# EAGLE design shield carte avant (EAGLE 9.2.1)
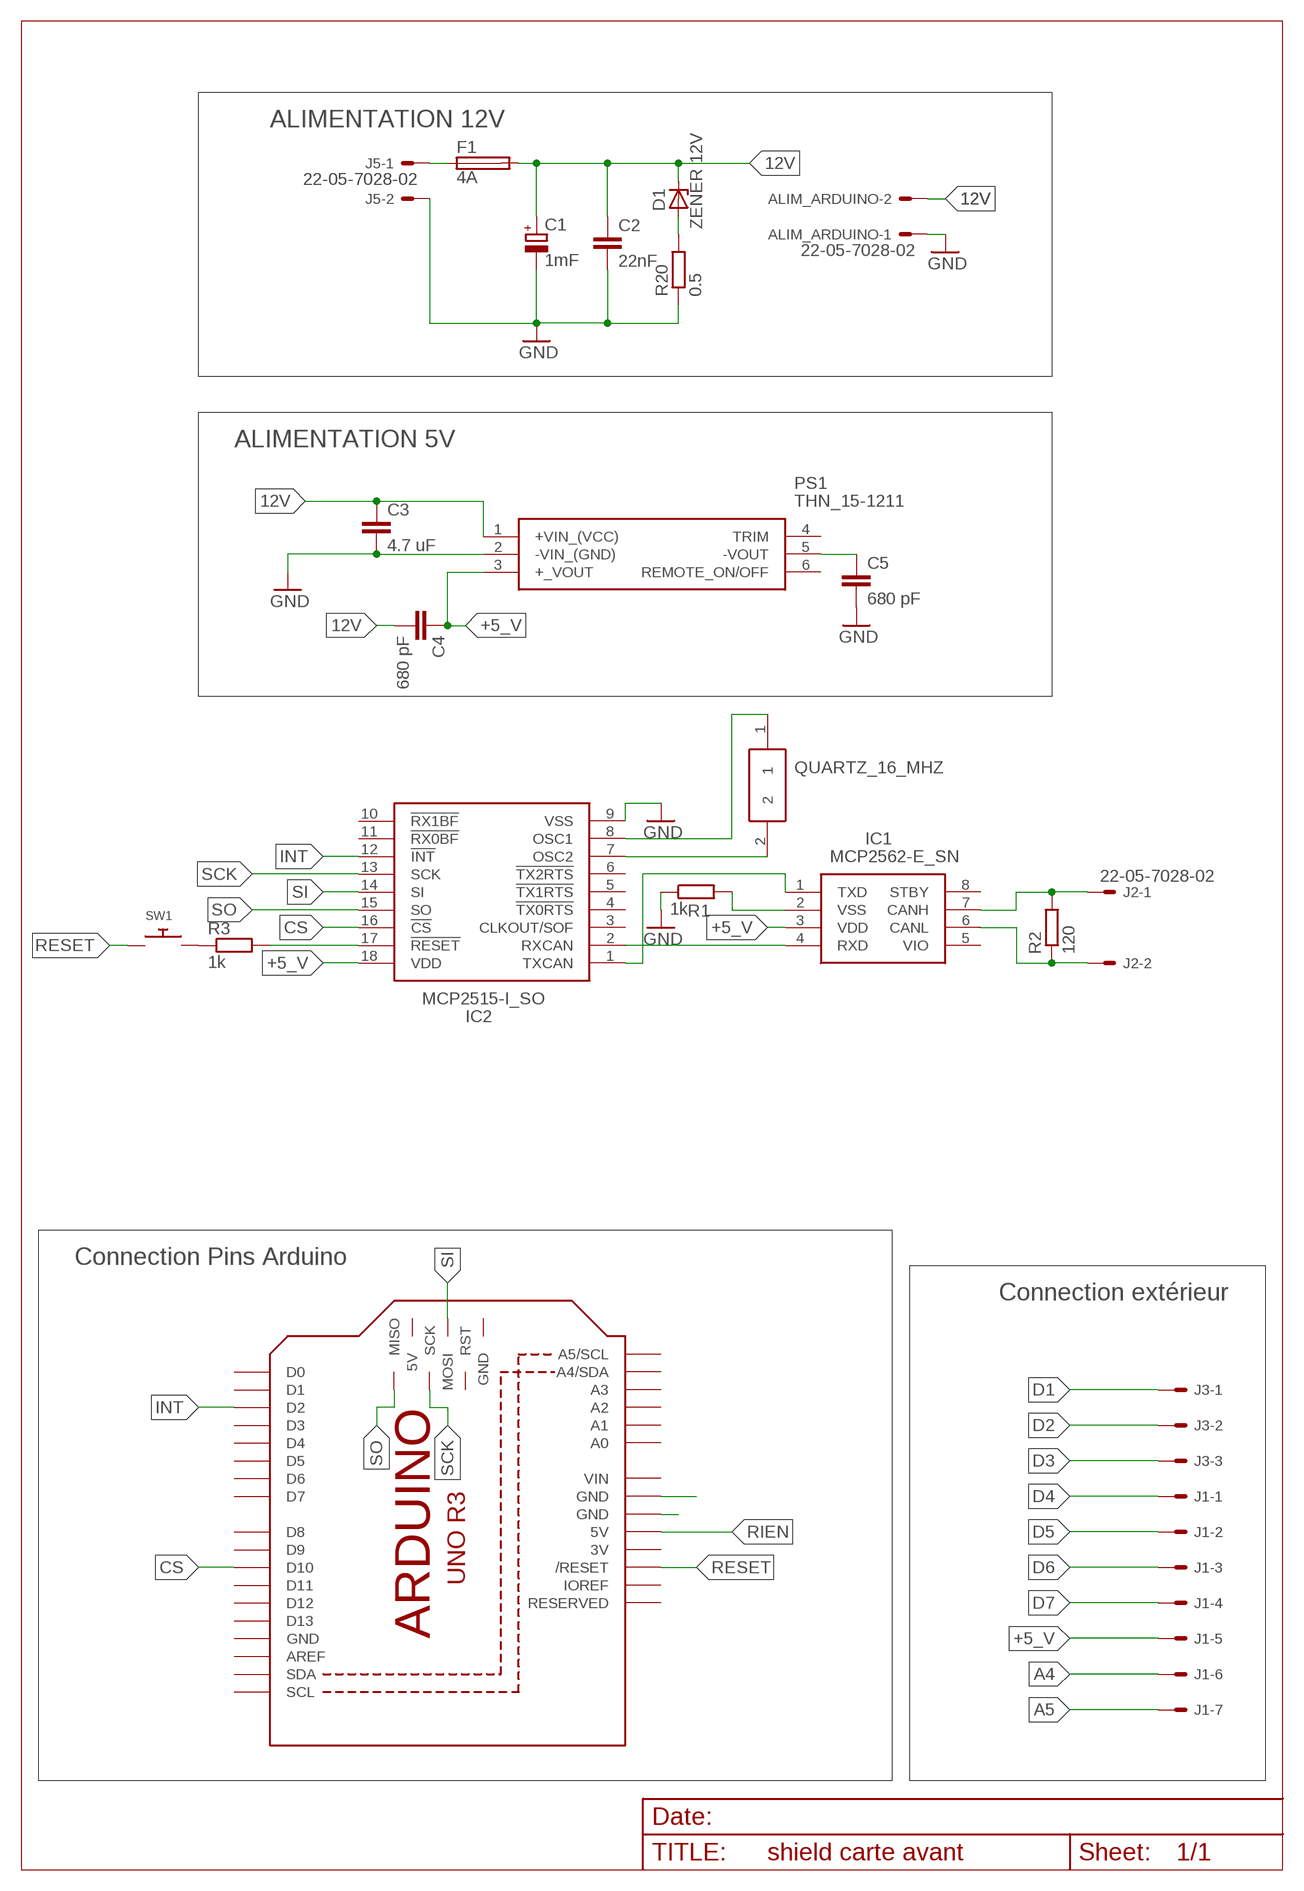
[diagram p0: schematic, sheet 1]

## Parts
ALIM_ARDUINO  22-05-7028-02  [7395-02]
C1  1mF  CPOL-EUE7.5-16  [E7,5-16]
C2  22nF  C-EU025-025X050  [C025-025X050]
C3  4.7 uF  C-EU025-024X044  [C025-024X044]
C4  680 pF  C-EU025-024X044  [C025-024X044]
C5  680 pF  C-EU025-024X044  [C025-024X044]
D1  ZENER 12V  ZENER-DIODEDO41Z10  [DO41Z10]
F1  4A  SH25  [SH25]
IC1  MCP2562-E_SN  [SOIC127P600X175-8N]
IC2  MCP2515-I_SO  [SOIC127P1030X265-18N]
J1  22-05-7078-07  [7395-07]
J2  22-05-7028-02  [7395-02]
J3  22-05-7038-03  [7395-03]
J5  22-05-7028-02  [7395-02]
M1  ARDUINO_R3_ICSP  [ARDUINOR3_ICSP]
PS1  THN_15-1211  [THN-15-SERIES]
QUARTZ_16_MHZ  FOXSLF_160-20  [HC49SLF_1]
R1  1k  R-EU_0204/7  [0204/7]
R2  120  R-EU_0204/7  [0204/7]
R3  1k  R-EU_0204/7  [0204/7]
R20  0.5  R-EU_0309/12  [0309/12]
SW1  SWITCH_PUSHBUTTONEVQ-PE  [TACT_PANA-EVQ]

## Nets
12V [Vcc12]: ALIM_ARDUINO.2 C1.+ C2.1 C3.1 C4.2 D1.C F1.2 PS1.1(+VIN_(VCC))
+5_V: C4.1 IC1.3(VDD) IC2.18(VDD) J1.5 PS1.3(+_VOUT)
A4: J1.6
A5: J1.7
CS: IC2.16(!CS) M1.D10
D1: J3.1
D2: J3.2
D3: J3.3
D4: J1.1
D5: J1.2
D6: J1.3
D7: J1.4
GND: ALIM_ARDUINO.1 C1.- C2.2 C3.2 C5.2 IC2.9(VSS) J5.2 PS1.2(-VIN_(GND)) R1.1 R20.1
INT: IC2.12(!INT) M1.D2
N$1: F1.1 J5.1
N$3: C5.1 PS1.5(-VOUT)
N$4: D1.A R20.2
N$5: IC1.1(TXD) IC2.1(TXCAN)
N$6: IC1.4(RXD) IC2.2(RXCAN)
N$7: IC1.2(VSS) R1.2
N$8: IC1.7(CANH) J2.1 R2.2
N$9: IC1.6(CANL) J2.2 R2.1
N$10: IC2.7(OSC2) QUARTZ_16_MHZ.2
N$11: IC2.8(OSC1) QUARTZ_16_MHZ.1
N$13: M1.GND@1(GND)
N$14: R3.1 SW1.P$2
N$15: IC2.17(!RESET) R3.2
N$16: M1.GND@3(GND)
RESET: M1.RESET(/RESET) SW1.P$1
RIEN: M1.5V
SCK: IC2.13(SCK) M1.SCK
SI: IC2.14(SI) M1.MOSI
SO: IC2.15(SO) M1.MISO
Unconnected: IC1.5(VIO) IC1.8(STBY) IC2.3(CLKOUT/SOF) IC2.4(!TX0RTS) IC2.5(!TX1RTS) IC2.6(!TX2RTS) IC2.10(!RX1BF) IC2.11(!RX0BF) M1.5V_ICSP(5V) M1.A0 M1.A1 M1.A2 M1.A3 M1.A4(A4/SDA) M1.A5(A5/SCL) M1.AREF M1.D0 M1.D1 M1.D3 M1.D4 M1.D5 M1.D6 M1.D7 M1.D8 M1.D9 M1.D11 M1.D12 M1.D13 M1.GND@2(GND) M1.IOREF M1.RESERVED M1.RESET_ICSP(RST) M1.SCL M1.SDA PS1.4(TRIM) PS1.6(REMOTE_ON/OFF)

## Notes on the sheet
- ALIMENTATION 12V
- ALIMENTATION 5V
- Connection Pins Arduino
- Connection extérieur

## Power pins joined to a net without a drawn wire
3V: M1.3V
GND: M1.GND
VIN: M1.VIN

## Library data of the parts
ALIM_ARDUINO J5 = EP_molex_6410_7395:22-?-02: CONNECTOR wire to board 2.54 mm (.1 inch) pitch header
C1 = rcl:CPOL-EU: POLARIZED CAPACITOR, European symbol
C2 = rcl:C-EU: CAPACITOR, European symbol
C3-C5 = rcl:C-EU: CAPACITOR, European symbol; SPICEPREFIX: C
D1 = diode:ZENER-DIODE: Z-Diode
F1 = fuse:SH25: FUSE HOLDER grid 25 mm, OGN0031 8211, Schurter (Buerklin); MF: SCHURTER; MPN: 0031.8211; OC_FARNELL: 1162741; OC_NEWARK: 96B9380
IC1 = MCP2562-E_SN:MCP2562-E_SN: CAN Transceiver 1Mbps 5V 125degC SOIC8 CAN Transceiver 1MBps IEC 61000-4-2 Standby-Mode 8pins SOIC Source: Datasheet <http://uk.rs-online.com/web/p/products/7990228P>; ALLIED_NUMBER: 70415107; DESCRIPTION: CAN Transceiver 1Mbps 5V 125degC SOIC8 CAN Transceiver 1MBps IEC 61000-4-2 Standby-Mode 8pins SOIC; HEIGHT: 1.75mm; MANUFACTURER_NAME: Microchip; MANUFACTURER_PART_NUMBER: MCP2562-E/SN; RS_PART_NUMBER: 7990228P
IC2 = MCP2515-I_SO:MCP2515-I_SO: CAN Controller SPI data filtering SO18 Source: Datasheet <http://uk.rs-online.com/web/p/products/1445765>; ALLIED_NUMBER: 70045399; DESCRIPTION: CAN Controller SPI data filtering SO18; HEIGHT: 2.65mm; MANUFACTURER_NAME: Microchip; MANUFACTURER_PART_NUMBER: MCP2515-I/SO; RS_PART_NUMBER: 1445765
J1 = con-molex:22-?-07: CONNECTOR wire to board 2.54 mm (.1 inch) pitch header; MF: MOLEX; OC_FARNELL: unknown; OC_NEWARK: unknown
J2 = con-molex:22-?-02: CONNECTOR wire to board 2.54 mm (.1 inch) pitch header; MF: MOLEX; OC_FARNELL: 9731601; OC_NEWARK: unknown
J3 = con-molex:22-?-03: CONNECTOR wire to board 2.54 mm (.1 inch) pitch header; MF: MOLEX; OC_FARNELL: unknown; OC_NEWARK: unknown
M1 = adafruit:ARDUINO_R3_ICSP
PS1 = THN_15-1211:THN_15-1211: TRACOPOWER Isolated DC-DC Converter, Vin 9 18 V dc, Vout 5V dc, I/O isolation 1500V dc Source: Datasheet <http://uk.rs-online.com/web/p/products/0438272P>; DESCRIPTION: TRACOPOWER Isolated DC-DC Converter, Vin 9 18 V dc, Vout 5V dc, I/O isolation 1500V dc; HEIGHT: mm; MANUFACTURER_NAME: Traco Power; MANUFACTURER_PART_NUMBER: THN 15-1211; RS_PART_NUMBER: 0438272P
QUARTZ_16_MHZ = FOXSLF_160-20:FOXSLF_160-20: Crystal 16.000MHz HC49S HC-49-SLF Crystal 16MHz, ??30ppm, 2-Pin Source: Datasheet <http://uk.rs-online.com/web/p/products/1734298>; DESCRIPTION: Crystal 16.000MHz HC49S HC-49-SLF Crystal 16MHz, ??30ppm, 2-Pin; HEIGHT: mm; MANUFACTURER_NAME: Fox; MANUFACTURER_PART_NUMBER: FOXSLF/160-20; RS_PART_NUMBER: 1734298
R1-R3 = rcl:R-EU_: RESISTOR, European symbol; SPICEPREFIX: R
R20 = resistor:R-EU_: RESISTOR, European symbol
SW1 = adafruit:SWITCH_PUSHBUTTON: Buttons SOFTTOUCHSMD_SJ - Soft touch temporary push button (Super Junk Akihabara) Compatible with SKPMANE010 [Mouser: 688-SKPMAN] C&K_KSS = Digikey: KSS221GLFS

## Net classes
0 default: width 0.61 mm
1 Vcc12: width 1.016 mm

## Board
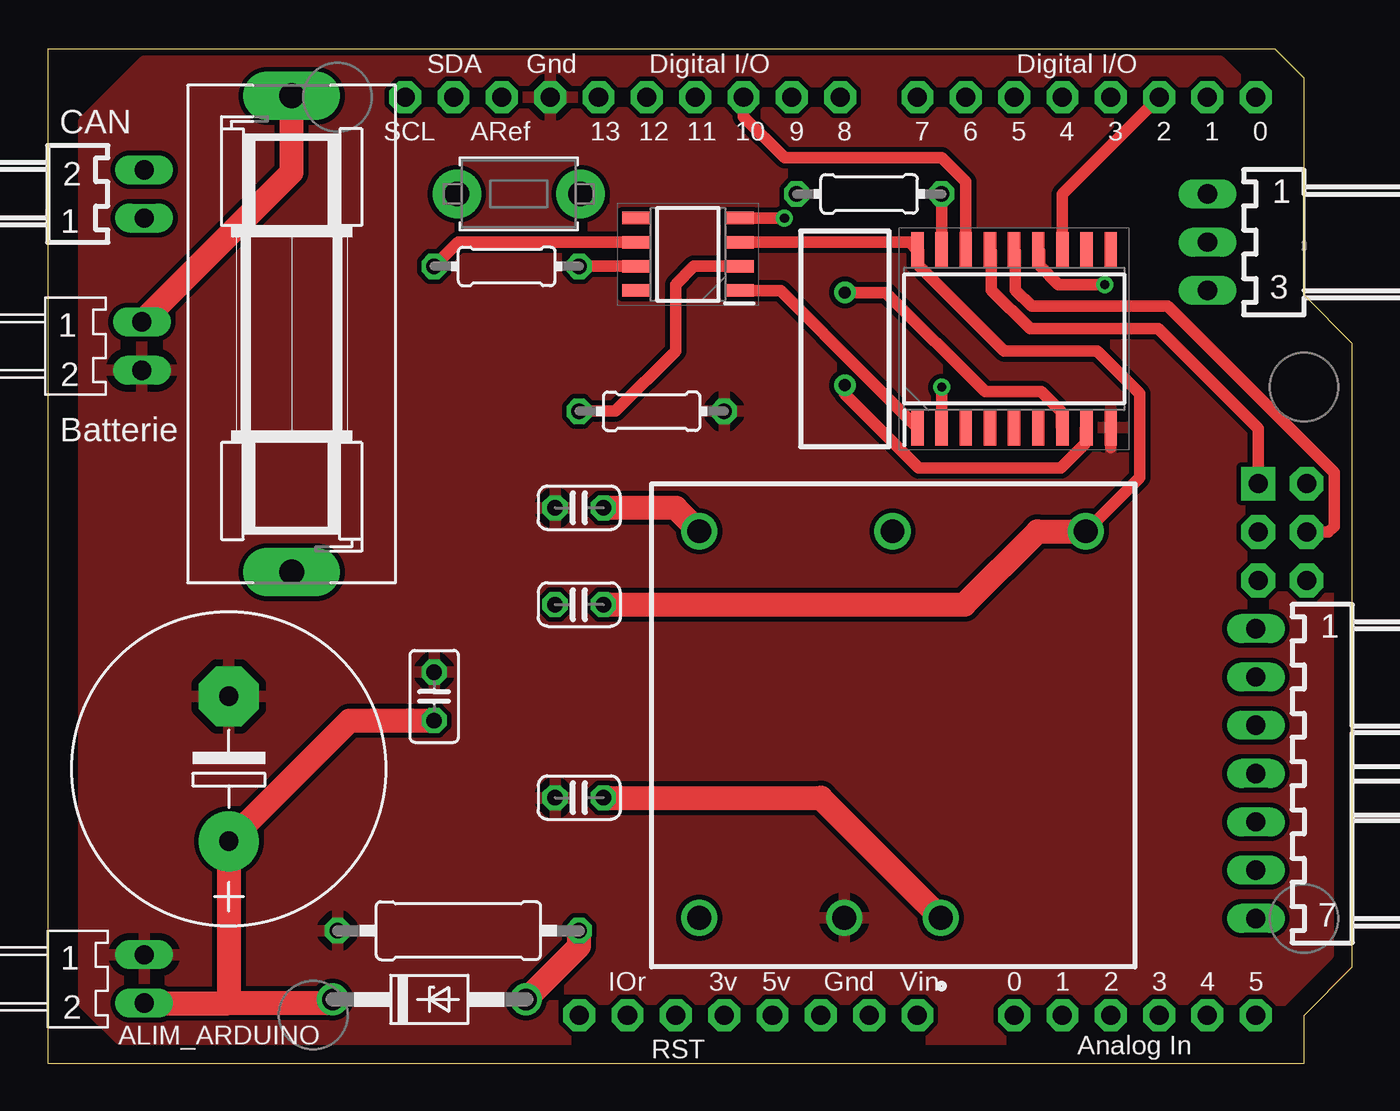
[diagram p1: board, top side]
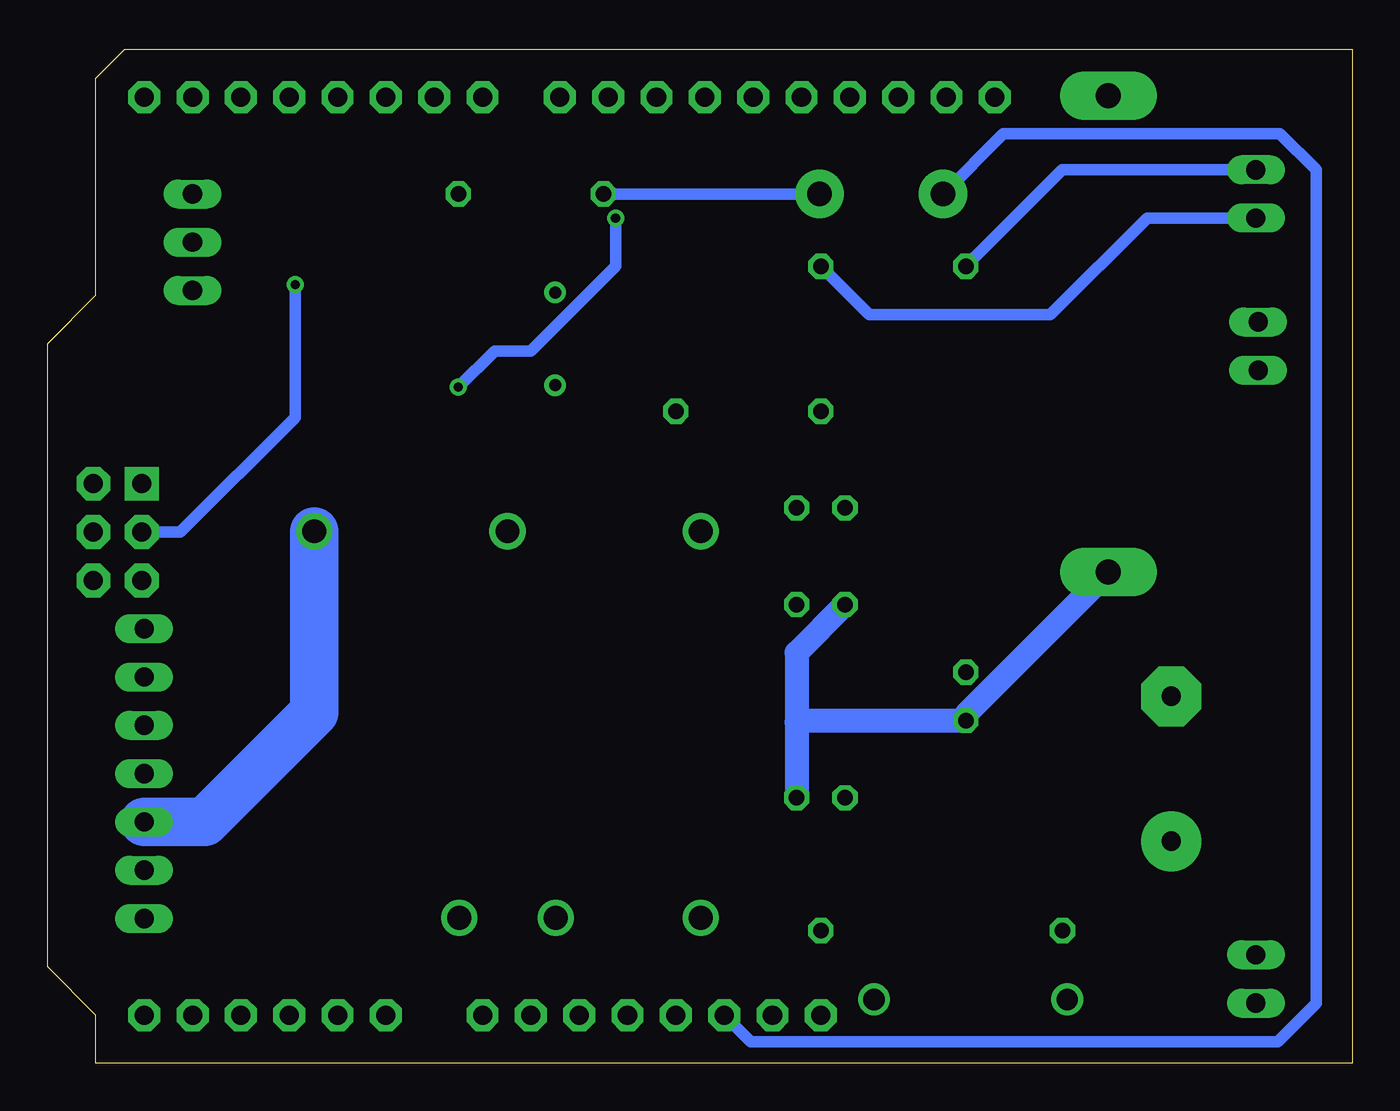
[diagram p2: board, bottom side, seen from below]

Size 68.58 x 53.34 mm. Coordinates in mm from the lower left corner, seen from the top.
Copper layers (1*16): Top 0.035mm / dielectric 1.5mm / Bottom 0.035mm
Design rules "default *": minimum track width 10mil, minimum drill 19mil, track to track 10mil, track to pad 10mil, pad to pad 0mil, via to via 10mil, smd to smd 0mil, copper to edge 10mil, drill to drill 8mil, minimum pad ring 10mil, minimum via ring 8mil, stop-mask expansion 4mil, vias tented up to drill 0mil, thermal gap 15mil

### Footprints (pad centres in the part's own frame; a part is rotated, then mirrored left to right if it is on the bottom)
7395-02 = drill 1.016 long: 1 1.27,0; 2 -1.27,0
E7,5-16 = drill 1.016 pad 3.15: + -3.81,0 | drill 1.016 pad 3.15 octagon: - 3.81,0
C025-025X050 = drill 0.813 octagon: 1 -1.27,0; 2 1.27,0
C025-024X044 = drill 0.813 octagon: 1 -1.27,0; 2 1.27,0
DO41Z10 = drill 1.118: A 5.08,0; C -5.08,0
SH25 = drill 1.321 pad 2.54 long: 1 -12.522,0; 2 12.522,0
SOIC127P600X175-8N = smd 1.5 x 0.65: 1 -2.7,1.905; 2 -2.7,0.635; 3 -2.7,-0.635; 4 -2.7,-1.905; 5 2.7,-1.905; 6 2.7,-0.635; 7 2.7,0.635; 8 2.7,1.905
SOIC127P1030X265-18N = smd 1.85 x 0.65: 1 -4.675,5.08; 2 -4.675,3.81; 3 -4.675,2.54; 4 -4.675,1.27; 5 -4.675,0; 6 -4.675,-1.27; 7 -4.675,-2.54; 8 -4.675,-3.81; 9 -4.675,-5.08; 10 4.675,-5.08; 11 4.675,-3.81; 12 4.675,-2.54; 13 4.675,-1.27; 14 4.675,0; 15 4.675,1.27; 16 4.675,2.54; 17 4.675,3.81; 18 4.675,5.08
7395-07 = drill 1.016 long: 1 7.62,0; 2 5.08,0; 3 2.54,0; 4 0,0; 5 -2.54,0; 6 -5.08,0; 7 -7.62,0
7395-03 = drill 1.016 long: 1 2.54,0; 2 0,0; 3 -2.54,0
ARDUINOR3_ICSP = drill 1 pad 1.676 octagon: 3V 35.56,2.54; 5V 38.1,2.54; A0 50.8,2.54; A1 53.34,2.54; A2 55.88,2.54; A3 58.42,2.54; A4 60.96,2.54; A5 63.5,2.54; AREF 23.876,50.8; D0 63.5,50.8; D1 60.96,50.8; D2 58.42,50.8; D3 55.88,50.8; D4 53.34,50.8; D5 50.8,50.8; D6 48.26,50.8; D7 45.72,50.8; D8 41.656,50.8; D9 39.116,50.8; D10 36.576,50.8; D11 34.036,50.8; D12 31.496,50.8; D13 28.956,50.8; GND 26.416,50.8; GND@1 43.18,2.54; GND@2 40.64,2.54; IOREF 30.48,2.54; RESERVED 27.94,2.54; RESET 33.02,2.54; SCL 18.796,50.8; SDA 21.336,50.8; VIN 45.72,2.54 | drill 1 pad 1.778 octagon: 5V_ICSP 66.167,30.48; GND@3 66.167,25.4; MOSI 66.167,27.94; RESET_ICSP 63.627,25.4; SCK 63.627,27.94 | drill 1 pad 1.778 square: MISO 63.627,30.48
THN-15-SERIES = drill 1.25 pad 1.9: 1 15.2,-22.82; 2 10.12,-22.82; 3 22.82,-2.5; 4 12.66,-2.5; 5 2.5,-2.5; 6 2.5,-22.82
HC49SLF_1 = drill 0.63 pad 1.13: 1 -2.44,0; 2 2.44,0
0204/7 = drill 0.813 octagon: 1 -3.81,0; 2 3.81,0
0309/12 = drill 0.813 octagon: 1 -6.35,0; 2 6.35,0
TACT_PANA-EVQ = drill 1.3 pad 2.54: P$1 -3.25,0; P$2 3.25,0

### Placement (x,y rotation side)
ALIM_ARDUINO  5.08,4.45 90 top
C1  9.53,15.49 90 top
C2  20.32,19.3 90 top
C3  27.94,13.97 180 top
C4  27.94,24.13 180 top
C5  27.94,29.21 180 top
D1  20.07,3.37 0 top
F1  12.83,38.35 270 top
IC1  33.65,42.55 180 top
IC2  50.8,38.1 90 top
J1  63.5,15.24 90 top
J2  5.08,45.72 270 top
J3  60.96,43.18 90 top
J5  4.95,37.72 90 top
M1  0,0 0 top
PS1  31.75,30.48 0 top
QUARTZ_16_MHZ  41.91,38.1 90 top
R1  31.75,34.29 180 top
R2  24.13,41.91 0 top
R3  43.18,45.72 0 top
R20  21.59,6.99 0 top
SW1  24.77,45.72 0 top

### Tracks (layer width: path | path; a pad name or v marks a point on that pad's centre or on a via)
12V
  Top 1.27: C2.1 15.88,18.03 C1.+ 9.53,3.17 | D1.C 14.8,3.17 9.53,3.17 | ALIM_ARDUINO.2 9.53,3.17 | C3.1 40.64,13.97 PS1.1
  Bottom 1.016: 20.32,18.34 C2.1 | C2.1 20.57,18.03 | C2.1 20.59,18.03 20.68,17.95
  Bottom 1.27: F1.2 20.32,18.34 | C4.2 29.21,21.59 29.21,17.95 | 29.21,17.95 29.12,18.03 C2.1 | 29.21,17.95 C3.1
+5_V
  Top 0.61: PS1.3 57.4,30.81 57.4,35.22 55.17,37.45 50.28,37.45 45.79,41.94 45.79,42.71 IC2.18 45.31,43.18 IC1.3
  Top 1.27: C4.1 48.18,24.13 52.03,27.98 PS1.3
  Bottom 2.54: J1.5 60.32,12.7 54.57,18.45 PS1.3
CS
  Top 0.61: IC2.16 48.26,46.35 46.99,47.62 38.73,47.62 36.58,49.78 M1.D10
GND
  Top 0.61: 55.88,32.38 IC2.9
  pour Top: 1.9,49.53 5.08,52.7 61.59,52.7 64.77,49.53 64.77,39.37 67.31,36.83 67.31,5.71 62.87,1.27 3.81,1.27 1.9,3.17
INT
  Top 0.61: IC2.12 53.34,45.72 M1.D2
N$1
  Top 1.27: J5.1 12.83,46.86 F1.1
N$3
  Top 1.27: PS1.5 33.02,29.21 C5.1
N$4
  Top 1.27: D1.A 27.94,6.16 R20.2
N$5
  Top 0.61: IC2.1 43.04,36.11 43.04,36.13 38.52,40.64 IC1.1
N$6  (via drill 0.48)
  Top 0.61: IC2.2 v46.99,35.56 | v38.73,44.44 38.72,44.45 IC1.4
  Bottom 0.61: v38.73,44.44 38.73,41.92 43.18,37.47 45.08,37.47 v46.99,35.56
N$7
  Top 0.61: IC1.2 33.97,41.91 33.02,40.96 33.02,37.47 29.84,34.29 R1.2
N$8
  Top 0.61: IC1.7 R2.2
  Bottom 0.61: J2.1 10.79,44.45 15.88,39.37 25.4,39.37 R2.2
N$9
  Top 0.61: R2.1 21.59,43.18 IC1.6
  Bottom 0.61: J2.2 15.24,46.99 R2.1
N$10
  Top 0.61: IC2.7 53.27,33.49 53.27,34.26 52.22,35.31 49.28,35.31 44.06,40.54 QUARTZ_16_MHZ.2
N$11
  Top 0.61: IC2.8 54.54,33.36 54.54,32.59 53.26,31.31 45.8,31.31 41.91,35.2 QUARTZ_16_MHZ.1
N$14
  Bottom 0.61: SW1.P$2 R3.1
N$15
  Top 0.61: R3.2 IC2.17
RESET
  Bottom 0.61: SW1.P$1 18.34,48.9 3.81,48.9 1.9,46.99 1.9,3.17 3.94,1.14 31.62,1.14 M1.RESET
SCK  (via drill 0.48)
  Top 0.61: v55.56,40.96 53.12,40.96 52.14,41.94 52.14,42.71 IC2.13
  Bottom 0.61: v55.56,40.96 55.56,33.97 61.59,27.94 M1.SCK
SI
  Top 0.61: IC2.14 50.87,42.71 50.87,40.67 51.72,39.81 58.88,39.81 67.62,31.08 67.62,28.25 67.31,27.94 M1.MOSI
SO
  Top 0.61: IC2.15 49.6,42.71 49.6,40.67 51.63,38.63 58.38,38.63 63.63,33.38 M1.MISO

### Text on the board
tNames: CAN | Batterie